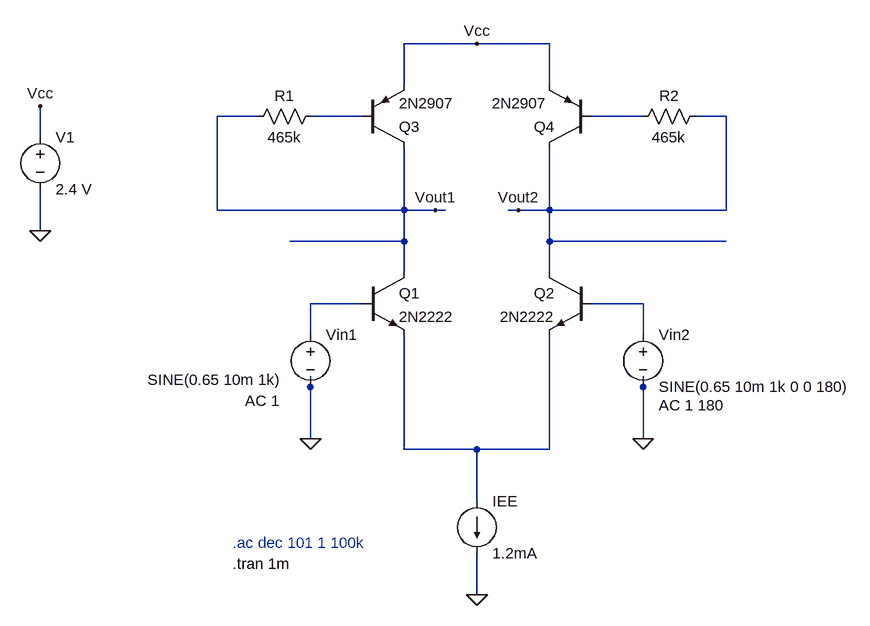
[diagram p0: schematic Draft1.asc]
Draft1.asc, the LTspice schematic file:
Version 4
SHEET 1 880 1012
WIRE 96 144 -16 144
WIRE 208 144 96 144
WIRE -16 208 -16 144
WIRE 208 208 208 144
WIRE -240 256 -304 256
WIRE -80 256 -160 256
WIRE 352 256 272 256
WIRE 480 256 432 256
WIRE -576 288 -576 240
WIRE -304 400 -304 256
WIRE -16 400 -16 304
WIRE -16 400 -304 400
WIRE 32 400 -16 400
WIRE 48 400 32 400
WIRE 160 400 144 400
WIRE 208 400 208 304
WIRE 208 400 160 400
WIRE 480 400 480 256
WIRE 480 400 208 400
WIRE -576 432 -576 368
WIRE -16 448 -16 400
WIRE -16 448 -192 448
WIRE 208 448 208 400
WIRE 480 448 208 448
WIRE -16 496 -16 448
WIRE 208 496 208 448
WIRE -80 544 -160 544
WIRE 352 544 272 544
WIRE -160 592 -160 544
WIRE 352 592 352 544
WIRE -160 672 -160 656
WIRE 352 672 352 656
WIRE -160 752 -160 672
WIRE 352 752 352 672
WIRE -16 768 -16 592
WIRE 96 768 -16 768
WIRE 208 768 208 592
WIRE 208 768 96 768
WIRE 96 848 96 768
WIRE 96 992 96 928
FLAG -576 432 0
FLAG -576 240 Vcc
FLAG 96 144 Vcc
FLAG 96 992 0
FLAG -160 752 0
FLAG 352 752 0
FLAG 32 400 Vout1
FLAG 160 400 Vout2
DATAFLAG 352 544 ""
DATAFLAG -160 544 ""
DATAFLAG -192 448 ""
DATAFLAG 480 448 ""
DATAFLAG 160 144 ""
DATAFLAG 96 768 ""
SYMBOL voltage -576 272 R0
WINDOW 123 0 0 Left 0
WINDOW 39 0 0 Left 0
SYMATTR InstName V1
SYMATTR Value 2.4 V
SYMBOL pnp -80 304 M180
SYMATTR InstName Q3
SYMATTR Value 2N2907
SYMBOL res -144 240 R90
WINDOW 0 0 56 VBottom 2
WINDOW 3 32 56 VTop 2
SYMATTR InstName R1
SYMATTR Value 465k
SYMBOL pnp 272 304 R180
WINDOW 3 68 68 Left 2
SYMATTR Value 2N2907
SYMATTR InstName Q4
SYMBOL res 448 240 R90
WINDOW 0 0 56 VBottom 2
WINDOW 3 32 56 VTop 2
SYMATTR InstName R2
SYMATTR Value 465k
SYMBOL npn -80 496 R0
SYMATTR InstName Q1
SYMATTR Value 2N2222
SYMBOL npn 272 496 M0
SYMATTR InstName Q2
SYMATTR Value 2N2222
SYMBOL current 96 848 R0
WINDOW 123 0 0 Left 0
WINDOW 39 0 0 Left 0
SYMATTR InstName IEE
SYMATTR Value 1.2mA
SYMBOL voltage -160 576 R0
WINDOW 123 -101 117 Left 2
WINDOW 39 0 0 Left 0
WINDOW 3 -251 85 Left 2
SYMATTR Value2 AC 1
SYMATTR Value SINE(0.65 10m 1k)
SYMATTR InstName Vin1
SYMBOL voltage 352 576 R0
WINDOW 123 24 124 Left 2
WINDOW 39 0 0 Left 0
SYMATTR Value2 AC 1 180
SYMATTR InstName Vin2
SYMATTR Value SINE(0.65 10m 1k 0 0 180)
TEXT -280 912 Left 2 ;.ac dec 101 1 100k
TEXT -280 944 Left 2 !.tran 1m

The netlist it stands for:
* Draft1.asc
V1 Vcc 0 2.4 V
Q3 Vout1 N001 Vcc 0 2N2907
R1 N001 Vout1 465k
Q4 Vout2 N002 Vcc 0 2N2907
R2 Vout2 N002 465k
Q1 Vout1 N003 N005 0 2N2222
Q2 Vout2 N004 N005 0 2N2222
IEE N005 0 1.2mA
Vin1 N003 0 SINE(0.65 10m 1k) AC 1
Vin2 N004 0 SINE(0.65 10m 1k 0 0 180) AC 1 180
.model NPN NPN
.model PNP PNP
.lib standard.bjt
* .ac dec 101 1 100k
.tran 1m
.backanno
.end